# Altium schematic sheet LCD9pin.SchDoc
size Letter; Author: FF7 HD Remastered
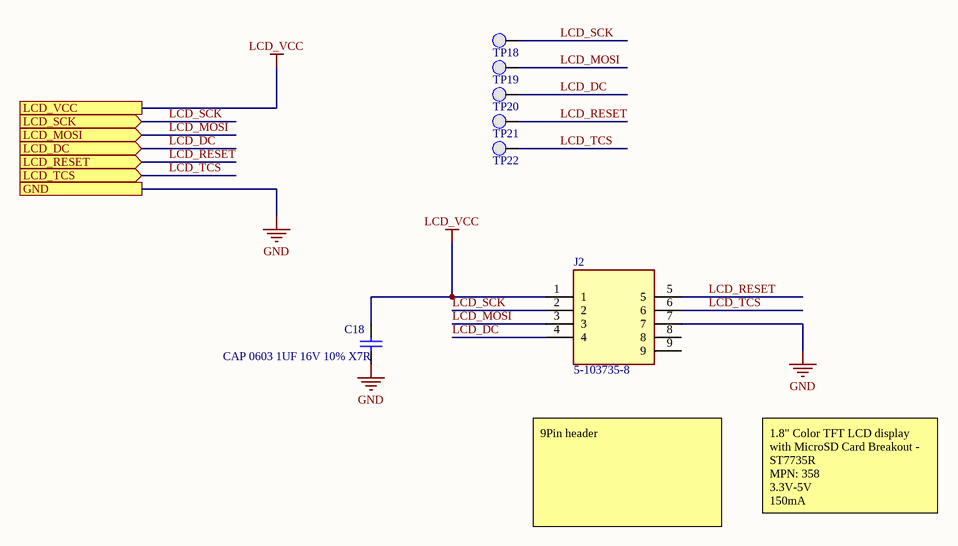
[diagram p0: LCD9pin.SchDoc]

## Parts
C18  CAP 0603 1UF 16V 10% X7R  [0603_CAP]
J2  5-103735-8  [TE_5-103735-8]
TP18  Test Point 0.1"  [Test Point 0.1"-Footprint-1]  (value not drawn)  (no BOM)
TP19  Test Point 0.1"  [Test Point 0.1"-Footprint-1]  (value not drawn)  (no BOM)
TP20  Test Point 0.1"  [Test Point 0.1"-Footprint-1]  (value not drawn)  (no BOM)
TP21  Test Point 0.1"  [Test Point 0.1"-Footprint-1]  (value not drawn)  (no BOM)
TP22  Test Point 0.1"  [Test Point 0.1"-Footprint-1]  (value not drawn)  (no BOM)

## Ports
GND, LCD_DC (in), LCD_MOSI (in), LCD_RESET (in), LCD_SCK (in), LCD_TCS (in), LCD_VCC

## Nets
GND: C18.1 J2.7 ; port GND
LCD_VCC: C18.2 J2.1 ; port LCD_VCC
LCD_DC: J2.4 TP20.1(PAD) ; port LCD_DC
LCD_MOSI: J2.3 TP19.1(PAD) ; port LCD_MOSI
LCD_RESET: J2.5 TP21.1(PAD) ; port LCD_RESET
LCD_SCK: J2.2 TP18.1(PAD) ; port LCD_SCK
LCD_TCS: J2.6 TP22.1(PAD) ; port LCD_TCS

Not connected (* = marked no-connect by the designer): J2 8 9

## Notes on the sheet
- 9Pin header
- 1.8" Color TFT LCD display with MicroSD Card Breakout - ST7735R
  MPN: 358
  3.3V-5V
  150mA
- Title:
- Desc:
- Size:
- Letter
- Auth:
- Proj:
- Sheet
- of
- www.seas.upenn.edu
- Electrical and Systems Engineering

## Library data of the parts
C18 = CMP-011-000286-1: Capacitor Surface Mount 0603 Footprint 1UF 16V 10% Tolerance Ceramic X7R; Manufacturer: Various; PCB Package: 0603; Description in Visual: Cap SMT 0603 1UF 16V 10% Ceramic X7R; P/N: CAP 0603 1UF 16V 10% X7R; Manufacturer P/N: CAP 0603 1UF 16V 10% X7R; Type: Ceramic X7R; Mount: SMT
J2 = 5-103735-8: Conn Shrouded Header HDR 9 POS 2.54mm Solder ST Thru-Hole Box/Tube; Number_of_Positions: 9; MF: TE Connectivity; Centerline_Pitch: 2.54 mm[.1 in]; Product_Type: Connector; MP: 5-103735-8; SnapEDA_Link: https://www.snapeda.com/parts/5-103735-8/TE%20Connectivity%20AMP%20Connectors/view-part/2675807/?ref=snap; Package: None; Value: *; Digi-Key_Part_Number: A33940-ND
TP18-TP22 = CMP-00086-1